# EAGLE design connection (EAGLE 7.2.1)
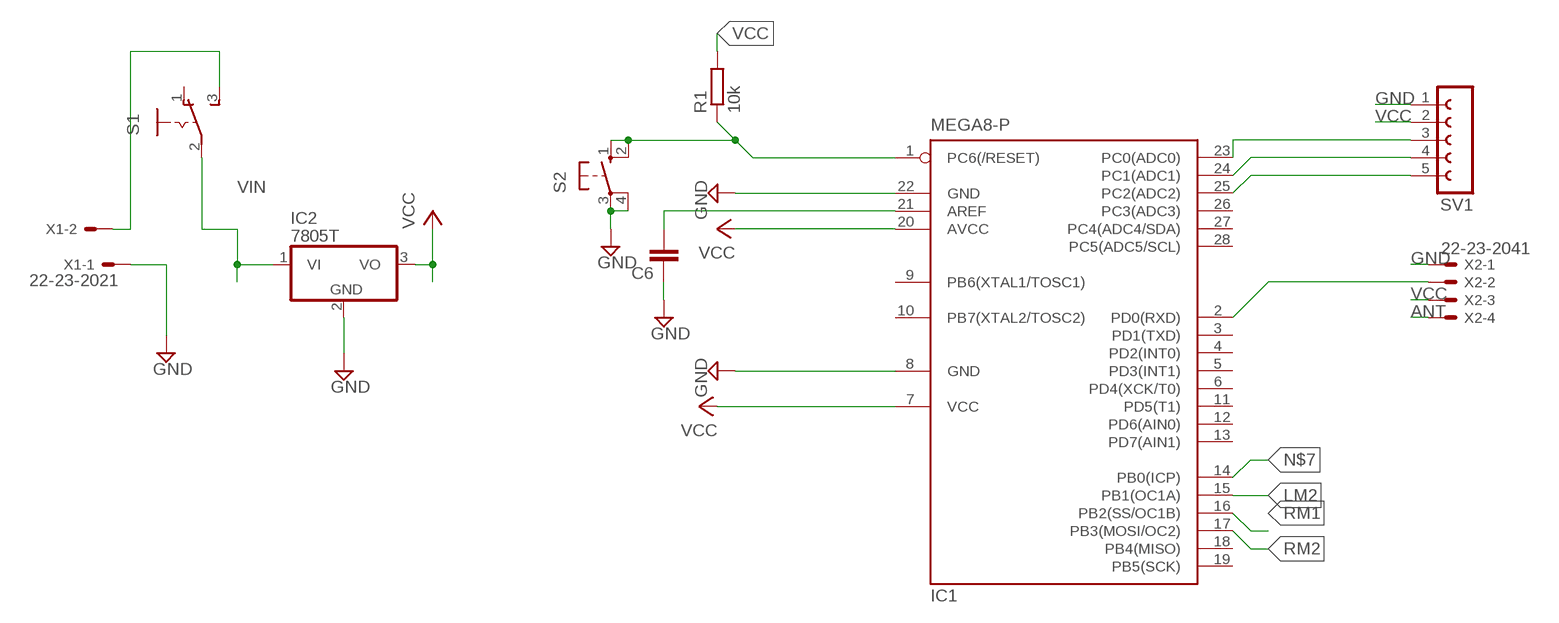
[diagram p0: schematic, sheet 1]

## Parts
C6  C5/2.5  [C5B2.5]
IC1  MEGA8-P  [DIL28-3]
IC2  7805T  [TO220H]
R1  10k  R-EU_0207/10  [0207/10]
S1  255SB  [255SB]
S2  10-XX  [B3F-10XX]
SV1  FE05W  [FE05W]
X1  22-23-2021  [22-23-2021]
X2  22-23-2041  [22-23-2041]

## Nets
ANT: X2.4
GND: C6.1 IC1.8(GND) IC1.22(GND) IC2.2(GND) S2.3(P) S2.4(P1) SV1.1 X1.1 X2.1
LM2: IC1.15(PB1(OC1A))
N$1: IC1.1(PC6(/RESET)) R1.1 S2.1(S) S2.2(S1)
N$2: C6.2 IC1.21(AREF)
N$5: S1.3(S) X1.2
N$6: IC1.23(PC0(ADC0)) SV1.3
N$7: IC1.14(PB0(ICP))
N$8: IC1.24(PC1(ADC1)) SV1.4
N$9: IC1.25(PC2(ADC2)) SV1.5
N$10: IC1.2(PD0(RXD)) X2.2
RM1: IC1.16(PB2(SS/OC1B))
RM2: IC1.17(PB3(MOSI/OC2))
VCC: IC1.7(VCC) IC1.20(AVCC) IC2.3(VO) R1.2 SV1.2 X2.3
VIN: IC2.1(VI) S1.2(P)
Unconnected: IC1.3(PD1(TXD)) IC1.4(PD2(INT0)) IC1.5(PD3(INT1)) IC1.6(PD4(XCK/T0)) IC1.9(PB6(XTAL1/TOSC1)) IC1.10(PB7(XTAL2/TOSC2)) IC1.11(PD5(T1)) IC1.12(PD6(AIN0)) IC1.13(PD7(AIN1)) IC1.18(PB4(MISO)) IC1.19(PB5(SCK)) IC1.26(PC3(ADC3)) IC1.27(PC4(ADC4/SDA)) IC1.28(PC5(ADC5/SCL)) S1.1(O)

## Library data of the parts
C6 = capacitor-wima:C: CAPACITOR naming: grid - package width
IC1 = atmel:MEGA8-P: MICROCONTROLLER 8 Kbytes FLASH, 1 kbytes SRAM, 512 bytes EEPROM, USART, 4-channel 10 bit ADC, 2-channel 8 bit ADC Pin compatible with Atmega48, ATMega88, ATMega168 Source: avr.lbr; OC_FARNELL: unknown; OC_NEWARK: unknown
IC2 = linear:78*: Positive VOLTAGE REGULATOR Source: http://cache.national.com/ds/LM/LM78L05.pdf http://www.fairchildsemi.com/ds/LM/LM7805.pdf
R1 = resistor:R-EU_: RESISTOR, European symbol
S1 = switch:255SB: SLIDING SWITCH Distributor Buerklin, 11G810
S2 = switch-omron:10-XX: OMRON SWITCH; MPN: B3F-1000; OC_FARNELL: 176432; OC_NEWARK: 36M3542
SV1 = con-lsta:FE05W: FEMALE HEADER; OC_FARNELL: unknown; OC_NEWARK: unknown
X1 = con-molex:22-23-2021: .100" (2.54mm) Center Header - 2 Pin; MF: MOLEX; MPN: 22-23-2021; OC_FARNELL: 1462926; OC_NEWARK: 25C3832
X2 = con-molex:22-23-2041: .100" (2.54mm) Center Header - 4 Pin; MF: MOLEX; MPN: 22-23-2041; OC_FARNELL: 1462920; OC_NEWARK: 38C0355

## Board
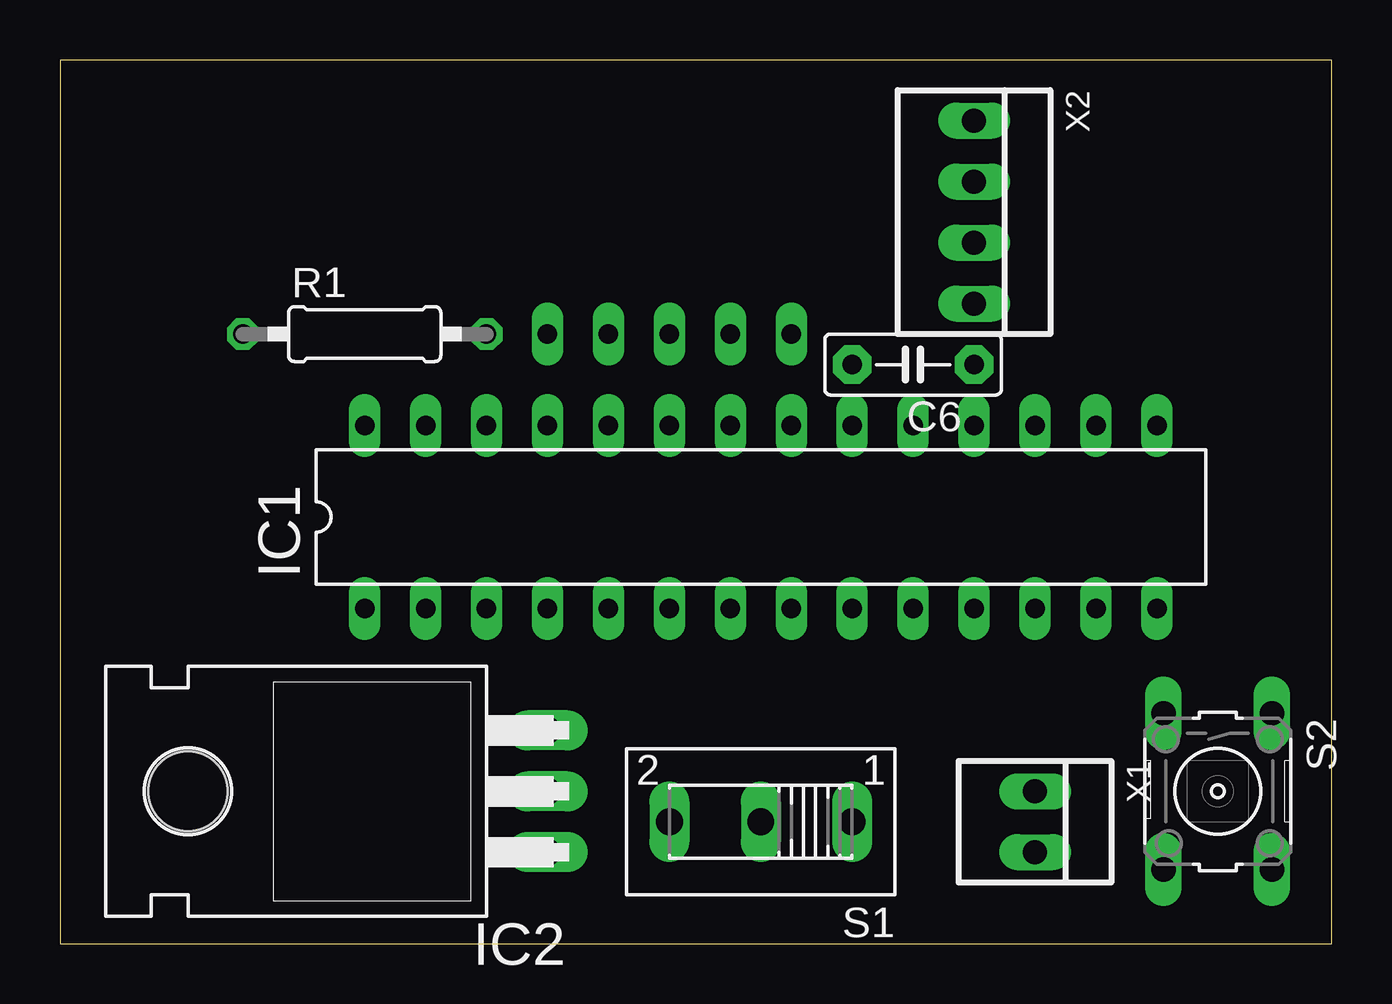
[diagram p1: board, top side]
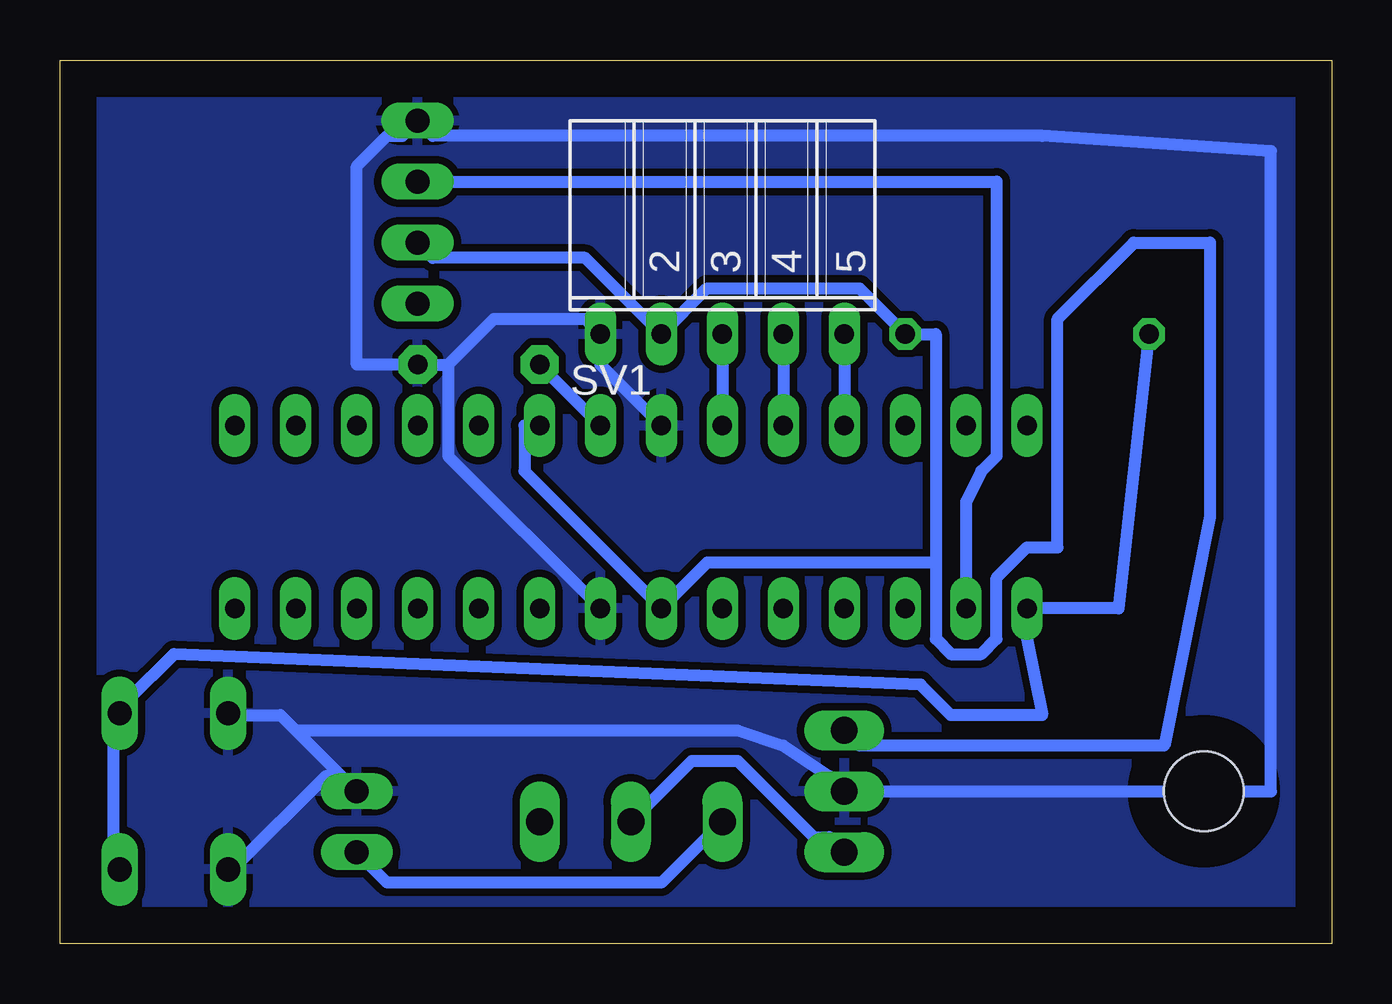
[diagram p2: board, bottom side, seen from below]

Size 53.01 x 36.82 mm. Coordinates in mm from the lower left corner, seen from the top.
Outline: 0,0 53.01,0 53.01,36.82 0,36.82 0,0
Copper layers (1*16): Top 0.035mm / dielectric 1.5mm / Bottom 0.035mm
Design rules "default *": minimum track width 20mil, minimum drill 24mil, track to track 12mil, track to pad 15mil, pad to pad 12mil, via to via 12mil, smd to smd 12mil, copper to edge 60mil, drill to drill 8mil, minimum pad ring 10mil, minimum via ring 8mil, stop-mask expansion 4mil, vias tented up to drill 0mil, thermal gap 10mil

### Footprints (pad centres in the part's own frame; a part is rotated, then mirrored left to right if it is on the bottom)
C5B2.5 = drill 0.813 pad 1.6 octagon: 1 -2.54,0; 2 2.54,0
DIL28-3 = drill 0.813 long: 1 -16.51,-3.81; 2 -13.97,-3.81; 3 -11.43,-3.81; 4 -8.89,-3.81; 5 -6.35,-3.81; 6 -3.81,-3.81; 7 -1.27,-3.81; 8 1.27,-3.81; 9 3.81,-3.81; 10 6.35,-3.81; 11 8.89,-3.81; 12 11.43,-3.81; 13 13.97,-3.81; 14 16.51,-3.81; 15 16.51,3.81; 16 13.97,3.81; 17 11.43,3.81; 18 8.89,3.81; 19 6.35,3.81; 20 3.81,3.81; 21 1.27,3.81; 22 -1.27,3.81; 23 -3.81,3.81; 24 -6.35,3.81; 25 -8.89,3.81; 26 -11.43,3.81; 27 -13.97,3.81; 28 -16.51,3.81
TO220H = drill 1.118 long: 1 -2.54,-10.16; 2 0,-10.16; 3 2.54,-10.16 | hole 3.302: 0,4.826
0207/10 = drill 0.813 octagon: 1 -5.08,0; 2 5.08,0
255SB = drill 1.118 long: 1 -3.81,0; 2 0,0; 3 3.81,0
B3F-10XX = drill 1.016 long: 1 -3.251,2.261; 2 3.251,2.261; 3 -3.251,-2.261; 4 3.251,-2.261
FE05W = drill 0.813 long: 1 -5.08,0; 2 -2.54,0; 3 0,0; 4 2.54,0; 5 5.08,0
22-23-2021 = drill 1 long: 1 -1.27,0; 2 1.27,0
22-23-2041 = drill 1 long: 1 -3.81,0; 2 -1.27,0; 3 1.27,0; 4 3.81,0

### Placement (x,y rotation side)
C6  35.56,24.13 180 top
IC1  29.21,17.78 0 top
IC2  10.16,6.35 90 top
R1  12.7,25.4 0 top
S1  29.21,5.08 180 top
S2  48.26,6.35 270 top
SV1  25.4,25.4 0 bottom
X1  40.64,5.08 270 top
X2  38.1,30.48 270 top

### Tracks (layer width: path | path; a pad name or v marks a point on that pad's centre or on a via)
GND
  Bottom 0.508: IC1.22 30.48,24.13 SV1.1 31.12,26.04 34.92,26.04 36.83,24.13 | IC1.8 36.83,20.32 36.83,24.13 | 36.83,24.13 C6.1 40.64,24.13 40.64,32.39 39.37,33.66 38.73,33.66 X2.1 37.47,33.66 12.06,33.66 2.54,33.02 2.54,6.35 IC2.2 20.95,6.98 22.86,8.25 24.77,8.89 43.18,8.89 | 43.18,8.89 43.81,9.52 45.72,9.52 S2.3 | 43.18,8.89 41.28,6.98 | 41.28,6.98 41.91,6.98 45.72,3.18 S2.4 | 41.28,6.98 X1.1
  pour Bottom: 0,36.83 53.34,36.83 53.34,0 0,0
N$1
  Bottom 0.508: S2.2 50.8,3.18 50.8,9.52 S2.1 50.17,10.16 48.26,12.07 17.15,10.79 15.88,9.52 12.06,9.52 12.7,12.7 IC1.1 8.89,13.97 R1.1
N$2
  Bottom 0.508: C6.2 IC1.21
N$5
  Bottom 0.508: X1.2 39.37,2.54 27.94,2.54 S1.3
N$6
  Bottom 0.508: SV1.3 IC1.23
N$8
  Bottom 0.508: SV1.4 IC1.24
N$9
  Bottom 0.508: SV1.5 IC1.25
N$10
  Bottom 0.508: IC1.2 15.24,18.42 14.61,19.68 13.97,20.32 13.97,31.75 X2.2
VCC
  Bottom 0.508: IC1.20 33.66,21.59 33.66,19.68 IC1.7 26.04,15.88 16.51,15.88 | X2.3 37.47,28.57 31.12,28.57 SV1.2 26.04,27.31 19.69,27.31 R1.2 16.51,25.4 16.51,15.88 | IC2.3 19.69,8.25 6.98,8.25 5.08,17.78 5.08,29.21 8.25,29.21 11.43,26.04 11.43,16.51 12.7,16.51 13.97,15.24 13.97,12.7 14.61,12.07 15.88,12.07 16.51,12.7 16.51,15.88
VIN
  Bottom 0.508: IC2.1 20.95,4.45 21.59,4.45 24.77,7.62 26.67,7.62 S1.2